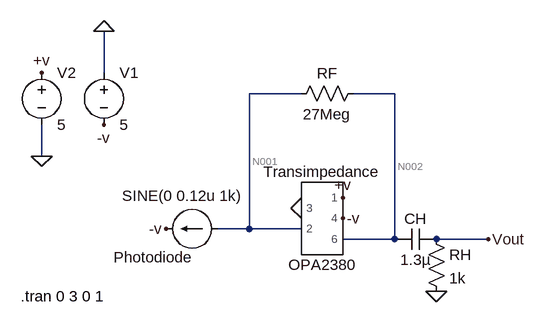
[diagram p0: schematic RX Final.asc]
RX Final.asc, the LTspice schematic file:
Version 4
SHEET 1 3004 788
WIRE 1952 144 1952 80
WIRE 2256 176 2176 176
WIRE 2400 176 2336 176
WIRE 1856 272 1856 224
WIRE 2176 384 2176 176
WIRE 2176 384 2128 384
WIRE 2256 384 2176 384
WIRE 2400 400 2400 176
WIRE 2400 400 2320 400
WIRE 2544 400 2464 400
FLAG 1856 272 0
FLAG 1952 80 0
FLAG 1856 144 +v
FLAG 1952 224 -v
FLAG 2320 336 +v
FLAG 2320 368 -v
FLAG 2048 384 -v
FLAG 2256 352 0
FLAG 2464 480 0
FLAG 2544 400 Vout
SYMBOL AutoGenerated\\OPA2380 2288 368 R0
SYMATTR InstName Transimpedance
SYMBOL voltage 1952 128 R0
WINDOW 123 0 0 Left 0
WINDOW 39 0 0 Left 0
SYMATTR InstName V1
SYMATTR Value 5
SYMBOL voltage 1856 128 R0
WINDOW 123 0 0 Left 0
WINDOW 39 0 0 Left 0
SYMATTR InstName V2
SYMATTR Value 5
SYMBOL current 2128 384 R90
WINDOW 123 0 0 Left 0
WINDOW 39 0 0 Left 0
WINDOW 0 44 39 VRight 2
WINDOW 3 -51 -37 VRight 2
SYMATTR InstName Photodiode
SYMATTR Value SINE(0 0.12u 1k)
SYMBOL res 2352 160 R90
WINDOW 0 0 56 VBottom 2
WINDOW 3 32 56 VTop 2
SYMATTR InstName RF
SYMATTR Value 27Meg
SYMBOL cap 2464 384 R90
WINDOW 0 0 32 VBottom 2
WINDOW 3 32 32 VTop 2
SYMATTR InstName CH
SYMATTR Value 1.3µ
SYMBOL res 2448 384 R0
SYMATTR InstName RH
SYMATTR Value 1k
TEXT 1824 488 Left 2 !.tran 0 3 0 1

The netlist it stands for:
* RX Final.asc
XTransimpedance 0 N001 +v -v N002 OPA2380  ; pins 3 2 1 4 6
V1 0 -v 5
V2 +v 0 5
I§Photodiode N001 -v SINE(0 0.12u 1k)
RF N002 N001 27Meg
CH Vout N002 1.3µ
RH Vout 0 1k
.tran 0 3 0 1
.lib E:\Documents\OneDrive - The University Of Newcastle\2020 Semester 1\Final Year Engineering Project Part A\Circuit (Air) (Indapendent Power Source)\OPA2380_PSPICE_AIO\OPA2380.LIB
.backanno
.end

* Results of the author's LTspice run, read from the files saved beside the schematic
* Operating Point, zero values left out:
*   V(+v) = 5 V
*   V(-v) = -5 V
*   V(n001) = -10.22 µV
*   V(n002) = 86.88 µV
*   I(Rf) = 3.596 pA
*   I(V2) = -8.65 mA
*   I(V1) = -8.65 mA
*   Ix(transimpedance:3) = 3.596 pA
*   Ix(transimpedance:2) = 3.596 pA
*   Ix(transimpedance:1) = 8.65 mA
*   Ix(transimpedance:4) = -8.65 mA
*   Ix(transimpedance:6) = -3.596 pA